# EAGLE design Micro RC Transmitter 1.1 (EAGLE 9.1.0)
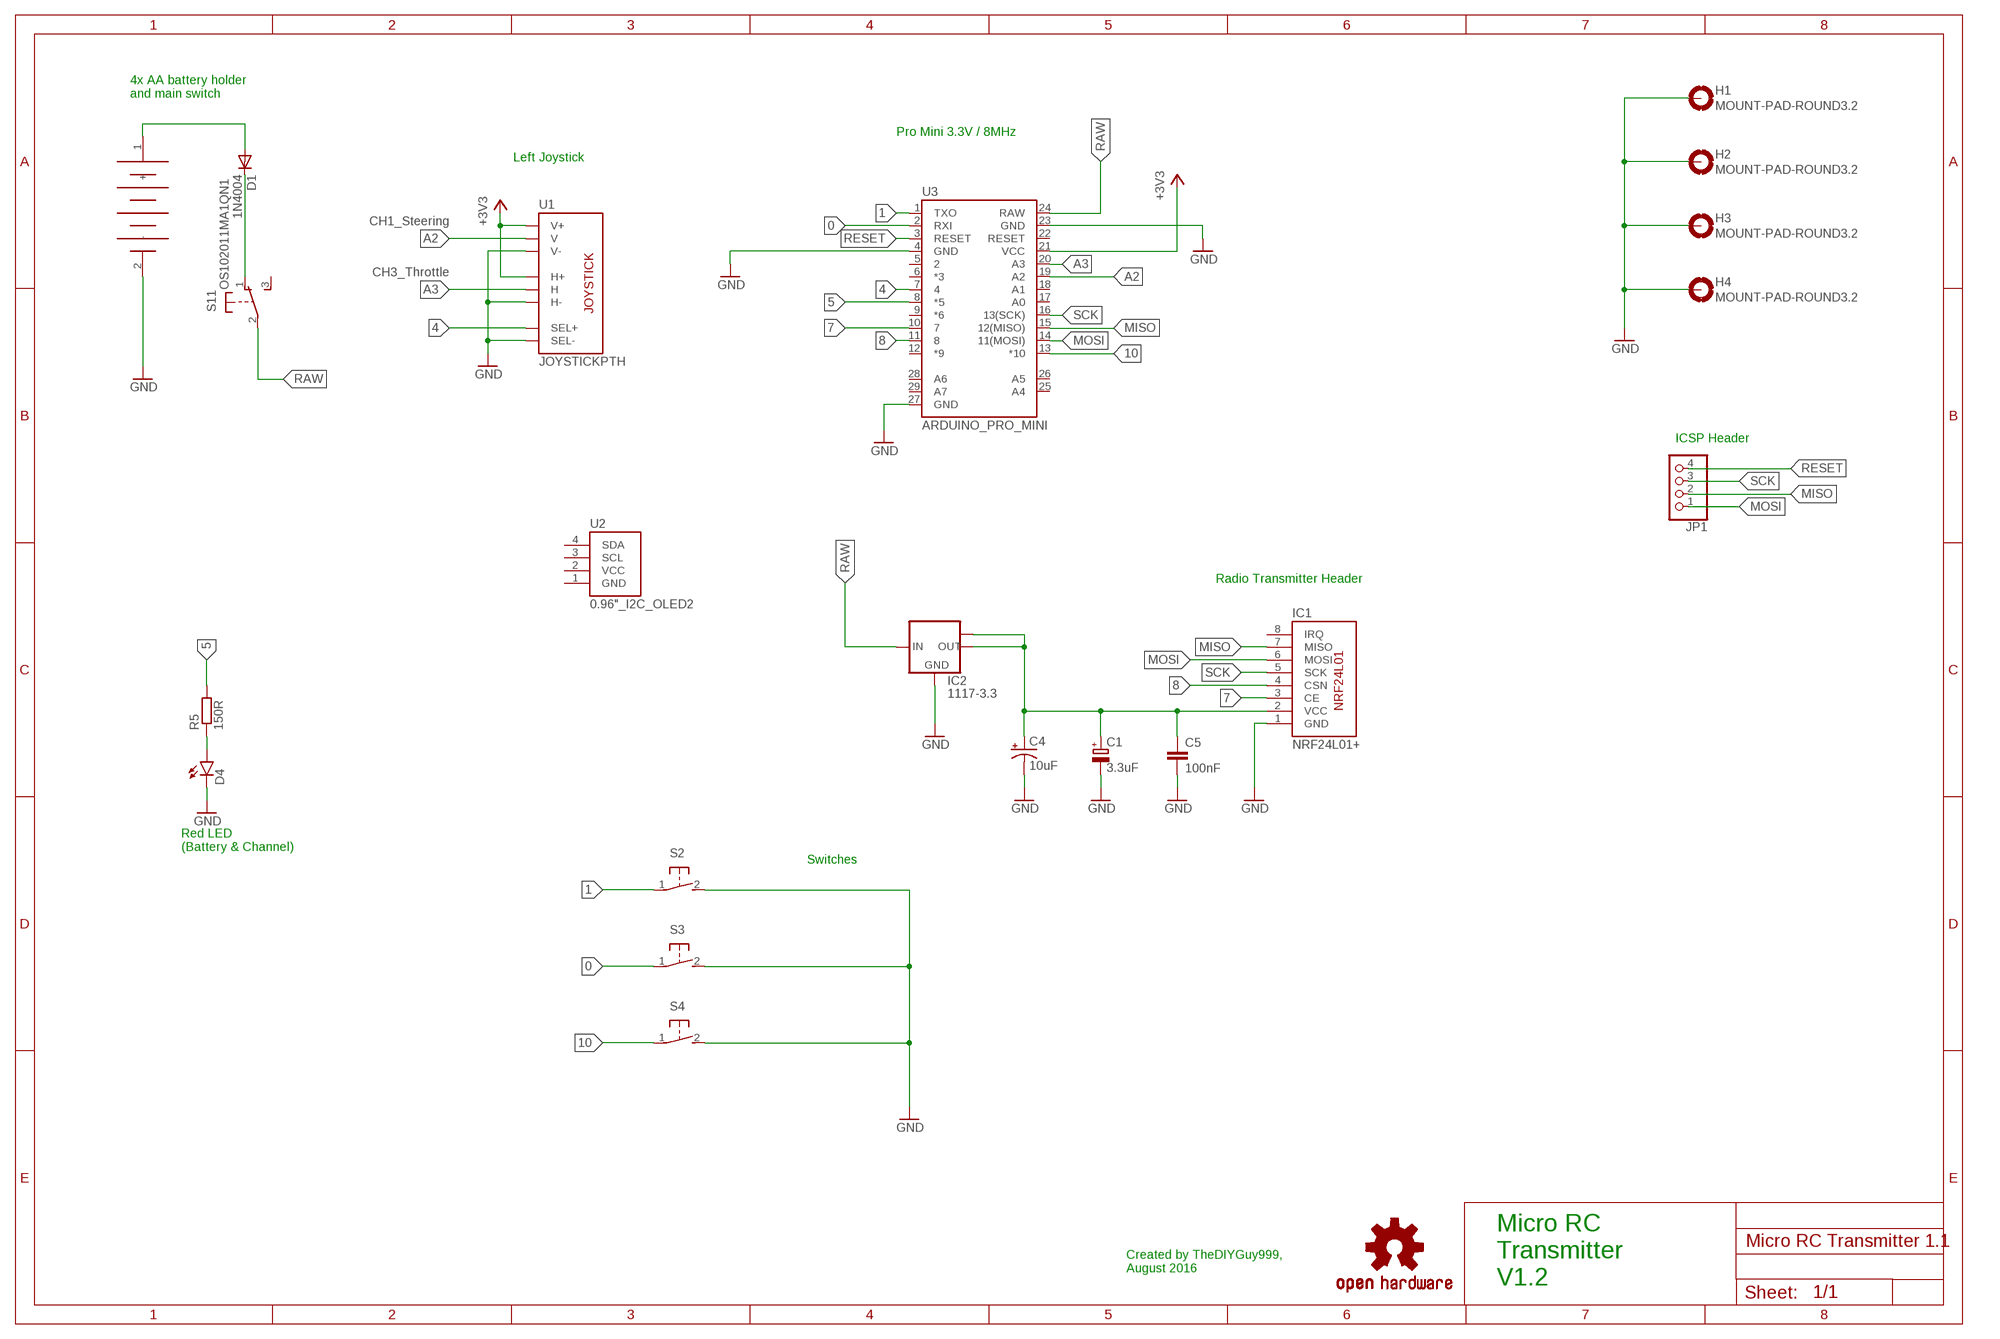
[diagram p0: schematic, sheet 1]

## Parts
C1  3.3uF  CPOL-EUB45181A  [B45181A]
C4  10uF  10UF-16V-10%(TANT)  [EIA3216]
C5  100nF  C-EUC0805  [C0805]
D1  1N4004  DIODE-DO-214AC  [DO-214AC]
D4  LED3MM  [LED3MM]
G1  4X_AA_BATTERY_HOLDER  [4X_AA_BATTERY_HOLDER]
H1  MOUNT-PAD-ROUND3.2  [3,2-PAD]
H2  MOUNT-PAD-ROUND3.2  [3,2-PAD]
H3  MOUNT-PAD-ROUND3.2  [3,2-PAD]
H4  MOUNT-PAD-ROUND3.2  [3,2-PAD]
IC1  NRF24L01+  NRF24L01  [NRF24L01]
IC2  1117-3.3  LM1117MPX-3.3  [SOT223]
JP1  PINHD-1X4  [1X04]
LOGO1  OSHW-LOGOM  [OSHW-LOGO-M]
R5  150R  R-EU_R0805  [R0805]
S1  OS102011MA1QN1  [OS102011MA1QN1]
S2  31-XX  [B3F-31XX]
S3  31-XX  [B3F-31XX]
S4  31-XX  [B3F-31XX]
U1  JOYSTICKPTH  [JOYSTICK]
U2  0.96"_I2C_OLED2  [0.96"_I2C_OLED_2]
U3  ARDUINO_PRO_MINI  [ARDUINO_PRO_MINI]

## Nets
0: S3.1(P) U3.2(RXI)
1: S2.1(P) U3.1(TXO)
4: U1.B1A(SEL+) U3.7
5: R5.2 U3.8(*5)
7: IC1.3(CE) U3.10
8: IC1.4(CSN) U3.11
10: S4.1(P) U3.13(*10)
+3V3: U1.H1(H+) U1.V1(V+) U3.21(VCC)
A2: U1.V2(V) U3.19(A2)
A3: U1.H2(H) U3.20(A3)
GND: C1.- C4.C(-) C5.2 D4.K(C) G1.2(-) H1.B3,2(MOUNT) H2.B3,2(MOUNT) H3.B3,2(MOUNT) H4.B3,2(MOUNT) IC1.1(GND) IC2.1(GND) S2.2(S) S3.2(S) S4.2(S) U1.B2A(SEL-) U1.H3(H-) U1.V3(V-) U3.4(GND) U3.23(GND) U3.27(GND)
MISO: IC1.7(MISO) JP1.2 U3.15(12(MISO))
MOSI: IC1.6(MOSI) JP1.1 U3.14(11(MOSI))
N$1: D4.A R5.1
N$7: D1.A G1.1(+)
N$8: D1.C S1.1(1:O)
N$9: C1.+ C4.A(+) C5.1 IC1.2(VCC) IC2.2(OUT) IC2.TAB(OUT1)
RAW: IC2.3(IN) S1.2(1:P) U3.24(RAW)
RESET: JP1.4 U3.3(RESET)
SCK: IC1.5(SCK) JP1.3 U3.16(13(SCK))
Unconnected: IC1.8(IRQ) S1.3(1:S) S1.MT1(MT) S1.MT2(MT) U2.1(GND) U2.2(VCC) U2.3(SCL) U2.4(SDA) U3.5 U3.6(*3) U3.9(*6) U3.12(*9) U3.17(A0) U3.18(A1) U3.22(RESET) U3.25(A4) U3.26(A5) U3.28(A6) U3.29(A7)

## Notes on the sheet
- 4x AA battery holder
  and main switch
- Pro Mini 3.3V / 8MHz
- Left Joystick
- CH1_Steering
- CH3_Throttle
- ICSP Header
- Radio Transmitter Header
- Red LED
  (Battery & Channel)
- Switches
- Created by TheDIYGuy999,
  August 2016
- Micro RC
  Transmitter
  V1.2

## Library data of the parts
C1 = rcl:CPOL-EU: POLARIZED CAPACITOR, European symbol
C4 = SparkFun-Capacitors:10UF-16V-10%(TANT): CAP-00811 1206/EIA-3216 Tantalum capacitor; PROD_ID: CAP-00811
C5 = rcl:C-EU: CAPACITOR, European symbol
D1 = diode:DIODE-: DIODE
D4 = SparkFun-LED:LED: LEDs Standard schematic elements and footprints for 5mm, 3mm, 1206, and 0603 sized LEDs. 5mm - Spark Fun Electronics SKU : COM-00529 (and others); PROD_ID: DIO-08794
G1 = 00_custom:4X_AA_BATTERY_HOLDER: http://www.ebay.ch/itm/401053643951?_trksid=p2060353.m2749.l2649&ssPageName=STRK%3AMEBIDX%3AIT
H1-H4 = holes:MOUNT-PAD-ROUND: MOUNTING PAD, round
IC1 = 00_custom:NRF24L01: 2.4GHz Radio Module
IC2 = lm1117:LM1117MPX-*
JP1 = 00_custom_pinhead:PINHD-1X4: PIN HEADER
LOGO1 = SparkFun-Aesthetics:OSHW-LOGO: Open Source Hardware Logo This logo indicates the piece of hardware it is found on incorporates a OSHW license and/or adheres to the definition of open source hardware found here: http://freedomdefined.org/OSHW
R5 = rcl:R-EU_: RESISTOR, European symbol; SPICEPREFIX: R
S1 = Sloan_Library:OS102011MA1QN1: E-Switch right-angle slide SPDT Part #EG1213 http://www.ladyada.net/library/eagle
S2-S4 = switch-omron:31-XX: OMRON SWITCH; MPN: B3F-3100; OC_FARNELL: 959704; OC_NEWARK: 36M3582
U1 = Sloan_Library:JOYSTICK: Thumb Joystick Joystick commonly found in PS2 controllers. Two pots and a select switch. Footprint proven. Spark Fun Electronics SKU : COM-09032
U2 = 00_custom:0.96"_I2C_OLED: http://www.ebay.ch/itm/White-0-96-I2C-IIC-Serial-128X64-OLED-LCD-LED-Display-Module-Arduino-/141676867755?
U3 = 00_custom:ARDUINO_PRO_MINI

## Board
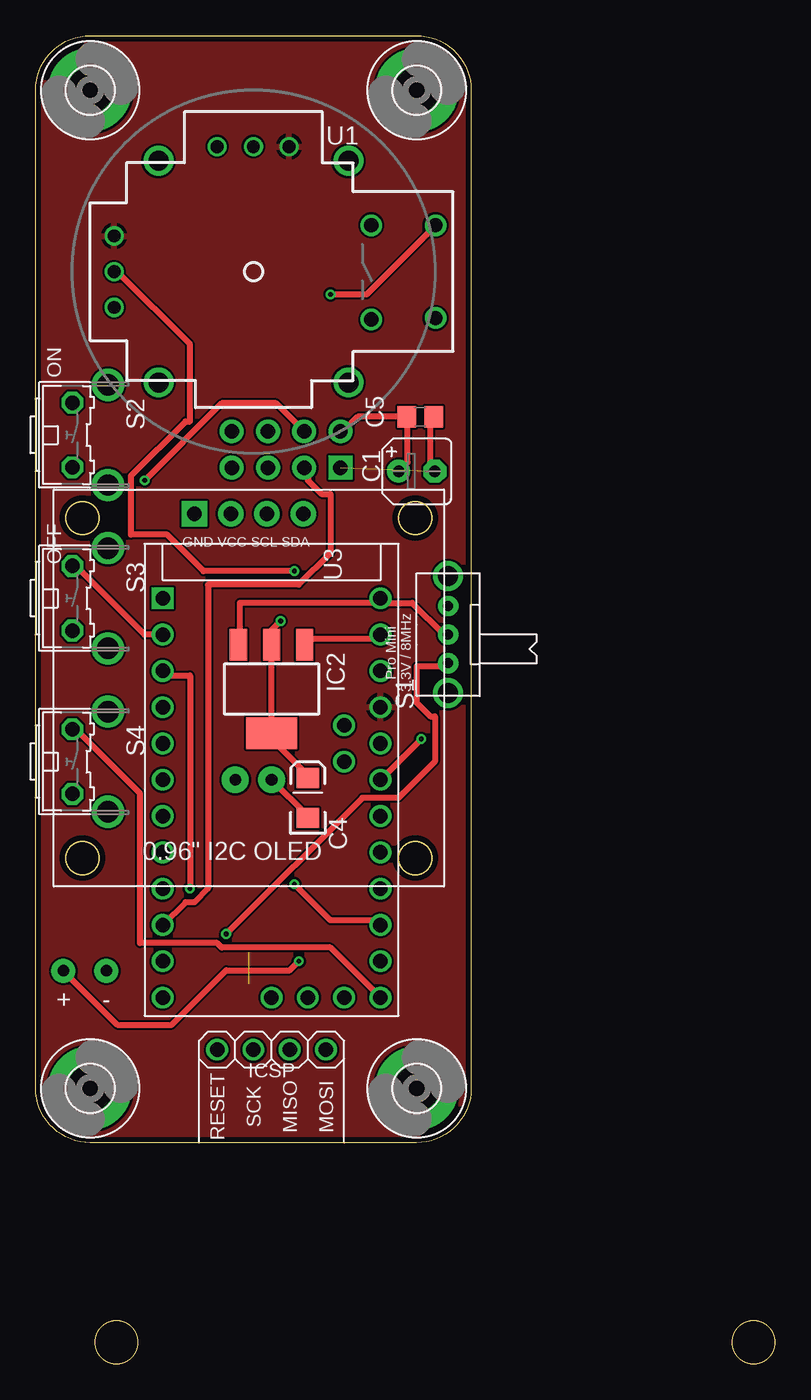
[diagram p1: board, top side]
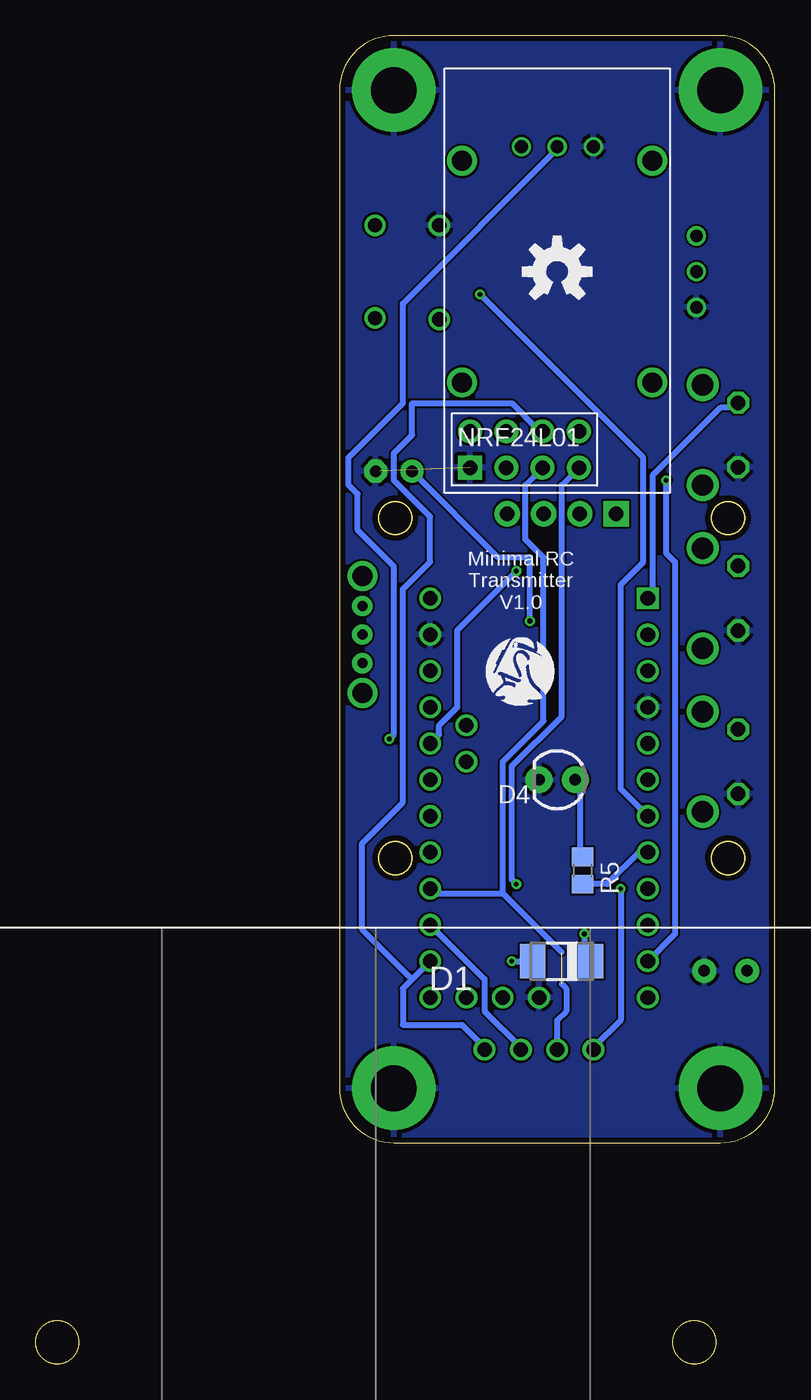
[diagram p2: board, bottom side, seen from below]

Size 30.48 x 77.47 mm. Coordinates in mm from the lower left corner, seen from the top.
Outline: 0,3.81 0,73.66 arc-90 3.81,77.47 26.67,77.47 arc-90 30.48,73.66 30.48,3.81 arc-90 26.67,0 3.81,0 arc-90 0,3.81
Copper layers (1*16): Top 0.0356mm / dielectric 1.5011mm / Bottom 0.0356mm
Design rules "OSHPark_LaenPCBOrder *": minimum track width 16mil, minimum drill 13mil, track to track 6mil, track to pad 6mil, pad to pad 6mil, via to via 6mil, smd to smd 6mil, copper to edge 15mil, drill to drill 6mil, minimum pad ring 7mil, minimum via ring 7mil, stop-mask expansion 3mil, vias tented up to drill 0mil, thermal gap 10mil

### Footprints (pad centres in the part's own frame; a part is rotated, then mirrored left to right if it is on the bottom)
B45181A = drill 0.813 pad 1.6: + -1.27,0 | drill 0.813 pad 1.6 octagon: - 1.27,0
EIA3216 = smd 1.4 x 1.6: A 1.4,0; C -1.4,0
C0805 = smd 1.3 x 1.5: 1 -0.95,0; 2 0.95,0
DO-214AC = smd 1.8 x 2.4: A 2.025,0; C -2.025,0
LED3MM = drill 0.813 pad 1.88: A -1.27,0; K 1.27,0
4X_AA_BATTERY_HOLDER = drill 0.8 pad 1.676: 1 26,26; 2 23,26
3,2-PAD = drill 3.2 pad 5.842: B3,2 0,0
NRF24L01 = drill 1.016 pad 1.676 square: 1 -1.27,1.27 | drill 1.016 pad 1.676: 2 -3.81,1.27; 3 -1.27,3.81; 4 -3.81,3.81; 5 -1.27,6.35; 6 -3.81,6.35; 7 -1.27,8.89; 8 -3.81,8.89
SOT223 = smd 1.219 x 2.235: 1 -2.311,-3.099; 2 0,-3.099; 3 2.311,-3.099 | smd 3.6 x 2.2: TAB 0,3.099
1X04 = drill 1.016: 1 -3.81,0; 2 -1.27,0; 3 1.27,0; 4 3.81,0
R0805 = smd 1.3 x 1.5: 1 -0.95,0; 2 0.95,0
OS102011MA1QN1 = drill 0.7 pad 1.422: 1 -2,0; 2 0,0; 3 2,0 | drill 1.4 pad 2.032: MT1 -4.1,0; MT2 4.1,0
B3F-31XX = drill 1.016 octagon: 1 -2.261,-1.245; 2 2.261,-1.245 | drill 1.499 pad 2.159: 3 -3.505,1.245; 4 3.505,1.245
JOYSTICK = drill 1: B1A -3.25,12.75; B1B 3.25,12.75; B2A -3.25,8.25; B2B 3.35,8.25 | drill 0.889: H1 -2.5,-9.75; H2 0,-9.75; H3 2.5,-9.75; V1 -8.75,2.5; V2 -8.75,0; V3 -8.75,-2.54 | drill 1.397: MOUNT1 -7.75,6.65; MOUNT2 -7.75,-6.65; MOUNT3 7.75,-6.65; MOUNT4 7.75,6.65
0.96"_I2C_OLED_2 = drill 1.016 pad 1.778 square: 1 9.84,-1.7 | drill 1.016 pad 1.778: 2 12.38,-1.7; 3 14.92,-1.7; 4 17.46,-1.7
ARDUINO_PRO_MINI = drill 1.016 square: 1 -7.62,12.7 | drill 1.016: 2 -7.62,10.16; 3 -7.62,7.62; 4 -7.62,5.08; 5 -7.62,2.54; 6 -7.62,0; 7 -7.62,-2.54; 8 -7.62,-5.08; 9 -7.62,-7.62; 10 -7.62,-10.16; 11 -7.62,-12.7; 12 -7.62,-15.24; 13 7.62,-15.24; 14 7.62,-12.7; 15 7.62,-10.16; 16 7.62,-7.62; 17 7.62,-5.08; 18 7.62,-2.54; 19 7.62,0; 20 7.62,2.54; 21 7.62,5.08; 22 7.62,7.62; 23 7.62,10.16; 24 7.62,12.7; 25 5.08,1.27; 26 5.08,3.81; 27 0,-15.24; 28 2.54,-15.24; 29 5.08,-15.24

### Placement (x,y rotation side)
C1  26.67,46.99 0 top
C4  19.05,24.13 90 top
C5  26.91,50.8 0 top
D1  14.92,12.7 180 bottom
D4  15.24,25.4 180 bottom
G1  27.94,-13.97 0 bottom
H1  3.81,73.66 0 top
H2  3.81,3.81 0 top
H3  26.67,73.66 0 top
H4  26.67,3.81 0 top
IC1  22.61,45.97 270 bottom
IC2  16.51,31.75 180 top
JP1  16.51,6.51 180 top
LOGO1  15.24,60.96 0 bottom
LOGO2  OSHW-LOGOM  [R2BUILDERS-LOGO]  20.32,30.48 0 bottom
R5  13.46,19.05 270 bottom
S1  28.87,35.56 90 top
S2  3.81,49.53 270 top
S3  3.81,38.1 270 top
S4  3.81,26.67 270 top
U1  15.24,60.96 270 top
U2  1.27,45.72 0 top
U3  16.51,25.4 0 top

### Tracks (layer width: path | path; a pad name or v marks a point on that pad's centre or on a via)
0
  Top 0.406: U3.2 7.62,35.56 2.86,40.32 S3.1
1
  Bottom 0.406: U3.1 8.57,38.42 8.57,46.67 3.81,51.44 2.86,51.44 2.86,51.75 S2.1
4  (via drill 0.33)
  Top 0.406: v20.64,59.37 23.18,59.37 27.94,64.14 U1.B1A
  Bottom 0.406: v20.64,59.37 9.21,47.94 9.21,40.64 10.79,39.05 10.79,24.77 U3.7
5
  Bottom 0.406: U3.8 9.53,20.32 11.75,18.1 13.34,18.1 R5.2
7
  Top 0.406: U3.10 10.48,16.83 11.11,16.83 12.06,17.78 12.06,39.05 18.41,39.05 20.64,41.27 20.64,45.4 20,45.4 19.05,46.36 19.05,46.99 IC1.3
8  (via drill 0.33)
  Top 0.406: v7.62,46.36 13.02,51.75 16.83,51.75 IC1.4
  Bottom 0.406: U3.11 6.99,14.6 6.99,40.64 7.62,41.27 v7.62,46.36
10
  Top 0.406: U3.13 20.64,13.65 13.02,13.65 12.7,13.97 7.3,13.97 7.3,24.45 2.86,28.89 S4.1
+3V3
  pour Top: -2.54,-3.81 -2.54,80.01 35.56,80.01 35.56,-3.81
A2  (via drill 0.33)
  Top 0.406: U3.19 v26.99,28.26
  Bottom 0.406: v26.99,28.26 26.67,28.58 26.67,40.32 29.21,42.86 29.21,45.4 29.84,46.04 29.84,47.94 26.04,51.75 26.04,58.74 15.24,69.53 U1.V2
A3  (via drill 0.33)
  Top 0.406: v18.1,40.01 11.75,40.01 9.21,42.55 6.67,42.55 6.67,46.67 10.48,50.48 10.79,50.48 10.79,55.88 5.71,60.96 U1.H2
  Bottom 0.406: v18.1,40.01 22.23,35.88 22.23,30.48 23.5,29.21 23.5,28.58 U3.20
GND  (1 unrouted)
  Top 0.406: C1.- 27.62,46.99 27.62,50.8 C5.2 | D4.K 19.05,22.86 C4.C | U3.23 23.81,35.24 19.37,35.24 19.05,34.93 IC2.1
  pour Bottom: -1.27,-3.81 -1.27,78.74 34.29,78.74 34.29,-3.81
MISO  (via drill 0.33)
  Top 0.406: v18.1,18.1 20.64,15.56 23.81,15.56 U3.15
  Bottom 0.406: U3.15 20.32,11.43 20.32,9.21 17.78,6.67 JP1.2 | IC1.7 14.92,46.04 14.92,29.84 18.41,26.35 18.41,18.41 v18.1,18.1
MOSI
  Bottom 0.406: U3.14 25.4,11.43 | 25.4,11.43 26.04,10.79 26.04,8.26 21.91,8.26 20.32,6.67 JP1.1 | 25.4,11.43 28.89,14.92 28.89,20.95 26.04,23.81 26.04,38.73 24.13,40.64 24.13,43.82 26.67,46.36 26.67,48.26 25.4,49.53 25.4,51.75 18.41,51.75 16.51,49.85 IC1.6
N$1
  Bottom 0.406: D4.A 13.65,25.08 13.65,20 R5.1
N$7  (via drill 0.33)
  Top 0.406: v18.41,12.7 17.78,12.06 13.34,12.06 9.53,8.26 5.71,8.26 G1.1
  Bottom 0.406: v18.41,12.7 D1.A
N$8  (via drill 0.33)
  Top 0.406: v13.34,14.6 22.86,24.13 25.4,24.13 27.94,26.67 27.94,29.84 27.62,29.84 26.67,30.8 26.67,33.34 28.57,33.34 S1.1
  Bottom 0.406: v13.34,14.6 13.34,13.02 13.02,12.7 D1.C
N$9  (via drill 0.33)
  Top 0.406: C1.+ 26.04,47.62 26.04,50.8 C5.1 22.54,50.8 21.59,49.85 IC1.2 | C4.A 19.05,25.72 16.51,28.26 IC2.TAB IC2.2 16.51,35.88 v17.14,36.51
  Bottom 0.406: C1.+ 19.37,40.96 17.14,40.96 v17.14,36.51
RAW
  Top 0.406: 23.81,37.78 14.29,37.78 14.29,34.93 IC2.3 | 23.81,37.78 26.35,37.78 28.57,35.56 S1.2 | 23.81,37.78 U3.24
RESET  (via drill 0.33)
  Top 0.406: v10.79,17.78 10.79,32.7 9.21,32.7 U3.3
  Bottom 0.406: v10.79,17.78 10.79,8.57 12.7,6.67 JP1.4
SCK  (1 unrouted)
  Bottom 0.406: JP1.3 15.24,8.57 14.61,9.21 14.61,10.79 14.92,11.11 | 19.05,17.46 14.92,13.33 | 19.05,17.46 24.13,17.46 U3.16 | IC1.5 17.46,46.04 17.46,42.23 16.19,40.96 16.19,29.53 19.05,26.67 19.05,17.46

### Text on the board
tNames: ON | OFF | Pro Mini / 3.3V / 8MHz | ICSP | RESET | SCK | MISO | MOSI
bNames: NRF24L01 | Minimal RC / Transmitter / V1.0